# Altium schematic sheet Block_Diagram.SchDoc
size A4; SheetNumber: 1; SheetTotal: 4
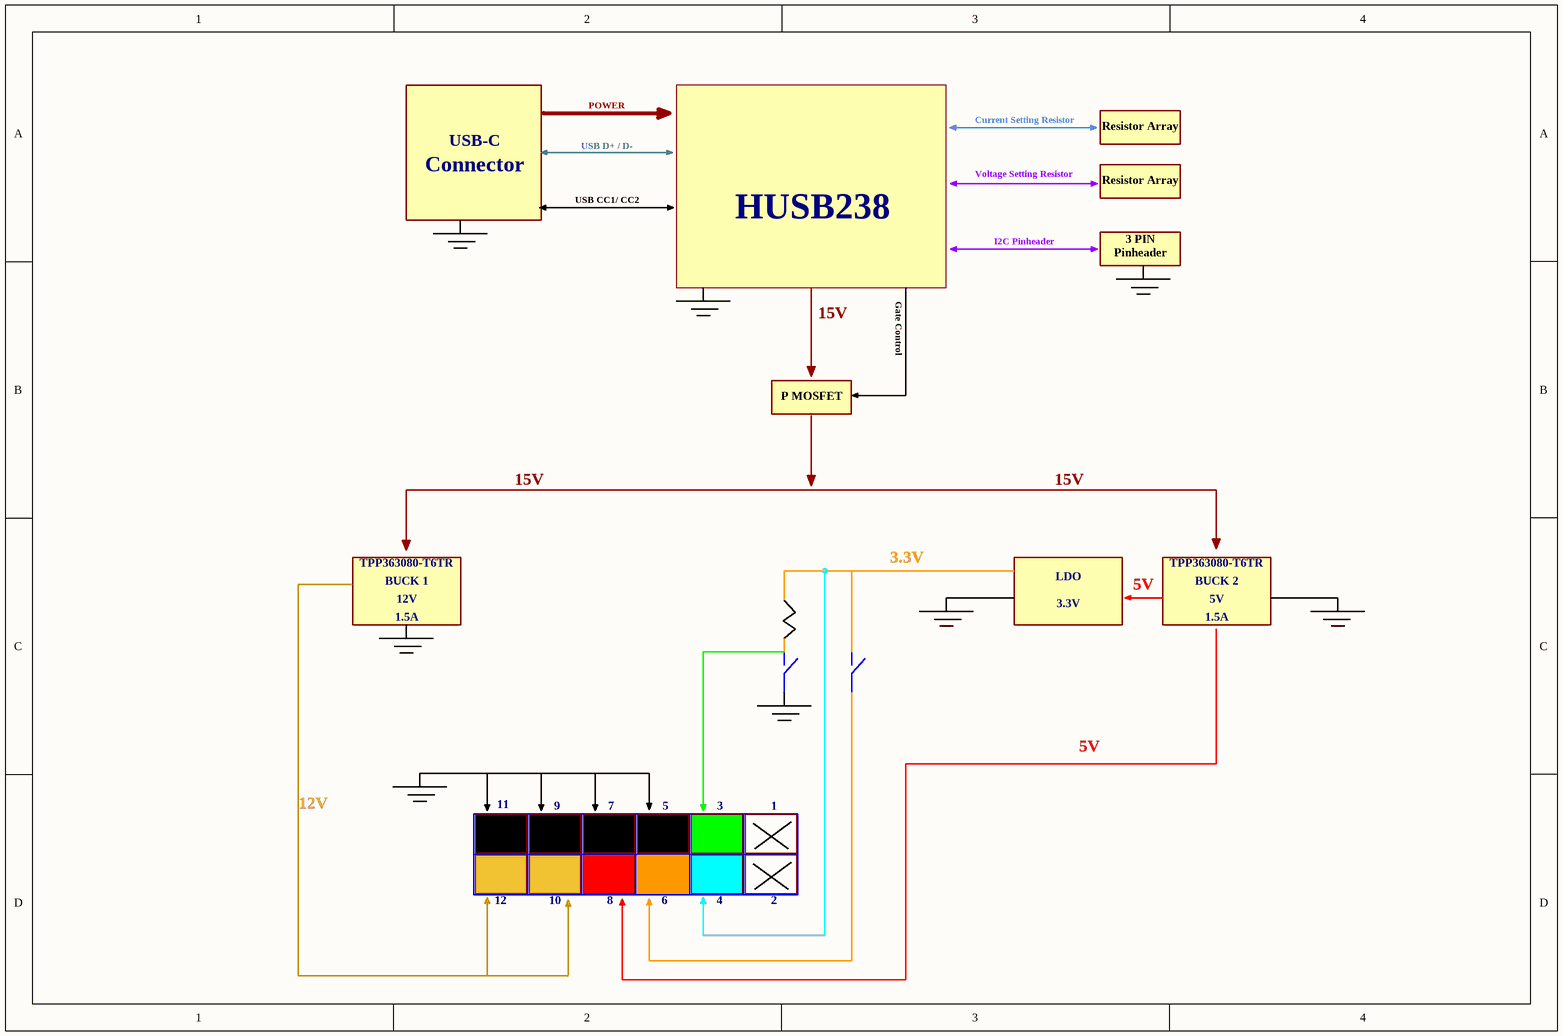
[diagram p0: Block_Diagram.SchDoc]

## Notes on the sheet
- POWER
- Connector
- USB-C
- USB D+ / D-
- Current Setting Resistor
- Voltage Setting Resistor
- Resistor Array
- USB CC1/ CC2
- HUSB238
- I2C Pinheader
- 3 PIN
- Gate Control
- Pinheader
- 15V
- P MOSFET
- TPP363080-T6TR
- BUCK 1
- 3.3V
- LDO
- BUCK 2
- 1.5A
- 12V
- 5V
- 11
- 9
- 7
- 5
- 3
- 1
- 12
- 10
- 8
- 6
- 4
- 2